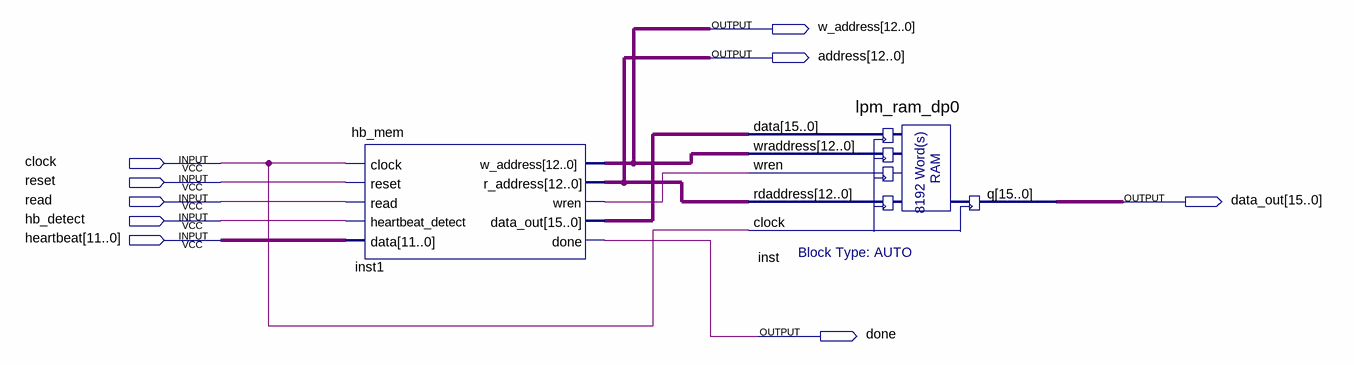
[diagram p0: schematic sheet]
// Quartus schematic top.bdf as structural Verilog: 2 symbols, 9 pins
module top (
  input  clock,
  input  reset,
  input  read,
  input  hb_detect,
  input  [11:0] heartbeat,
  output [12:0] w_address,
  output [12:0] address,
  output [15:0] data_out,
  output done
);

  wire inst1_wren;
  wire [15:0] inst1_data_out;

  hb_mem inst1 (
    .clock(clock), .reset(reset), .read(read), .heartbeat_detect(hb_detect), .data(heartbeat),
    .w_address(w_address), .r_address(address), .wren(inst1_wren), .data_out(inst1_data_out), .done(done));
  lpm_ram_dp0 inst (
    .data(inst1_data_out), .wraddress(w_address), .wren(inst1_wren), .rdaddress(address), .clock(clock),
    .q(data_out));
endmodule
